# EAGLE design ControllerBoardSMDPSU (EAGLE 9.6.2)
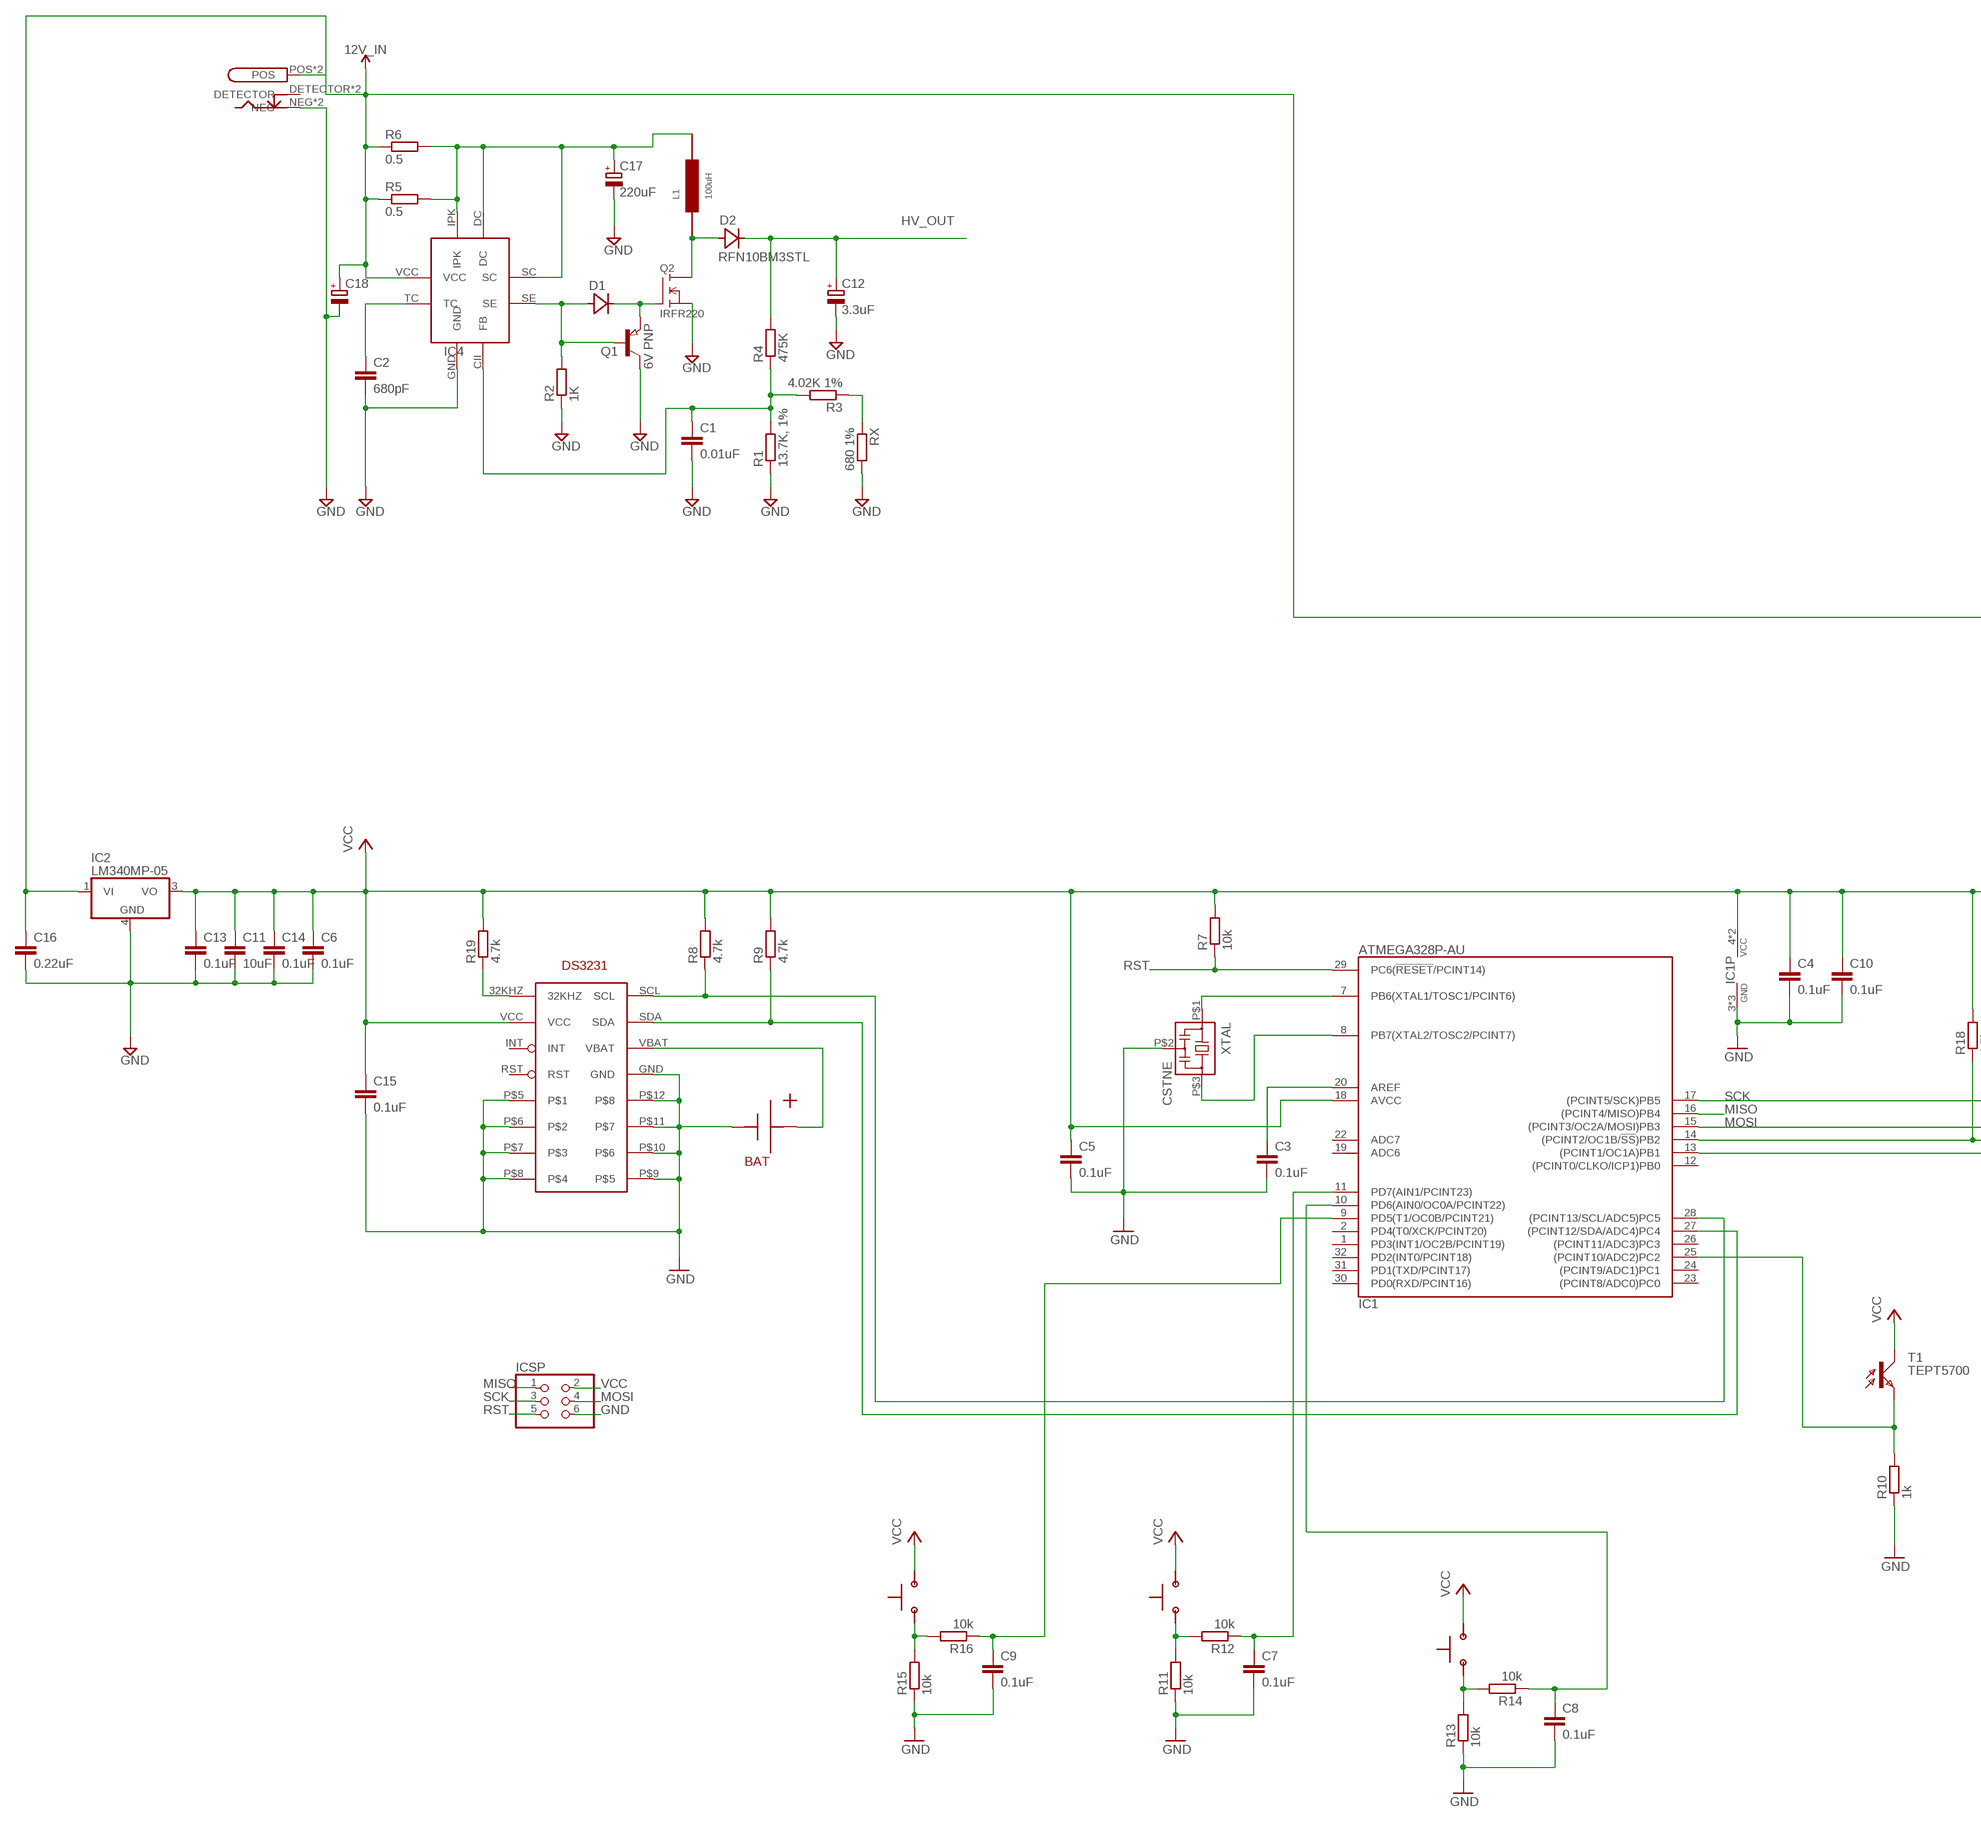
[diagram p0: schematic, sheet 1, part 1 of 2]
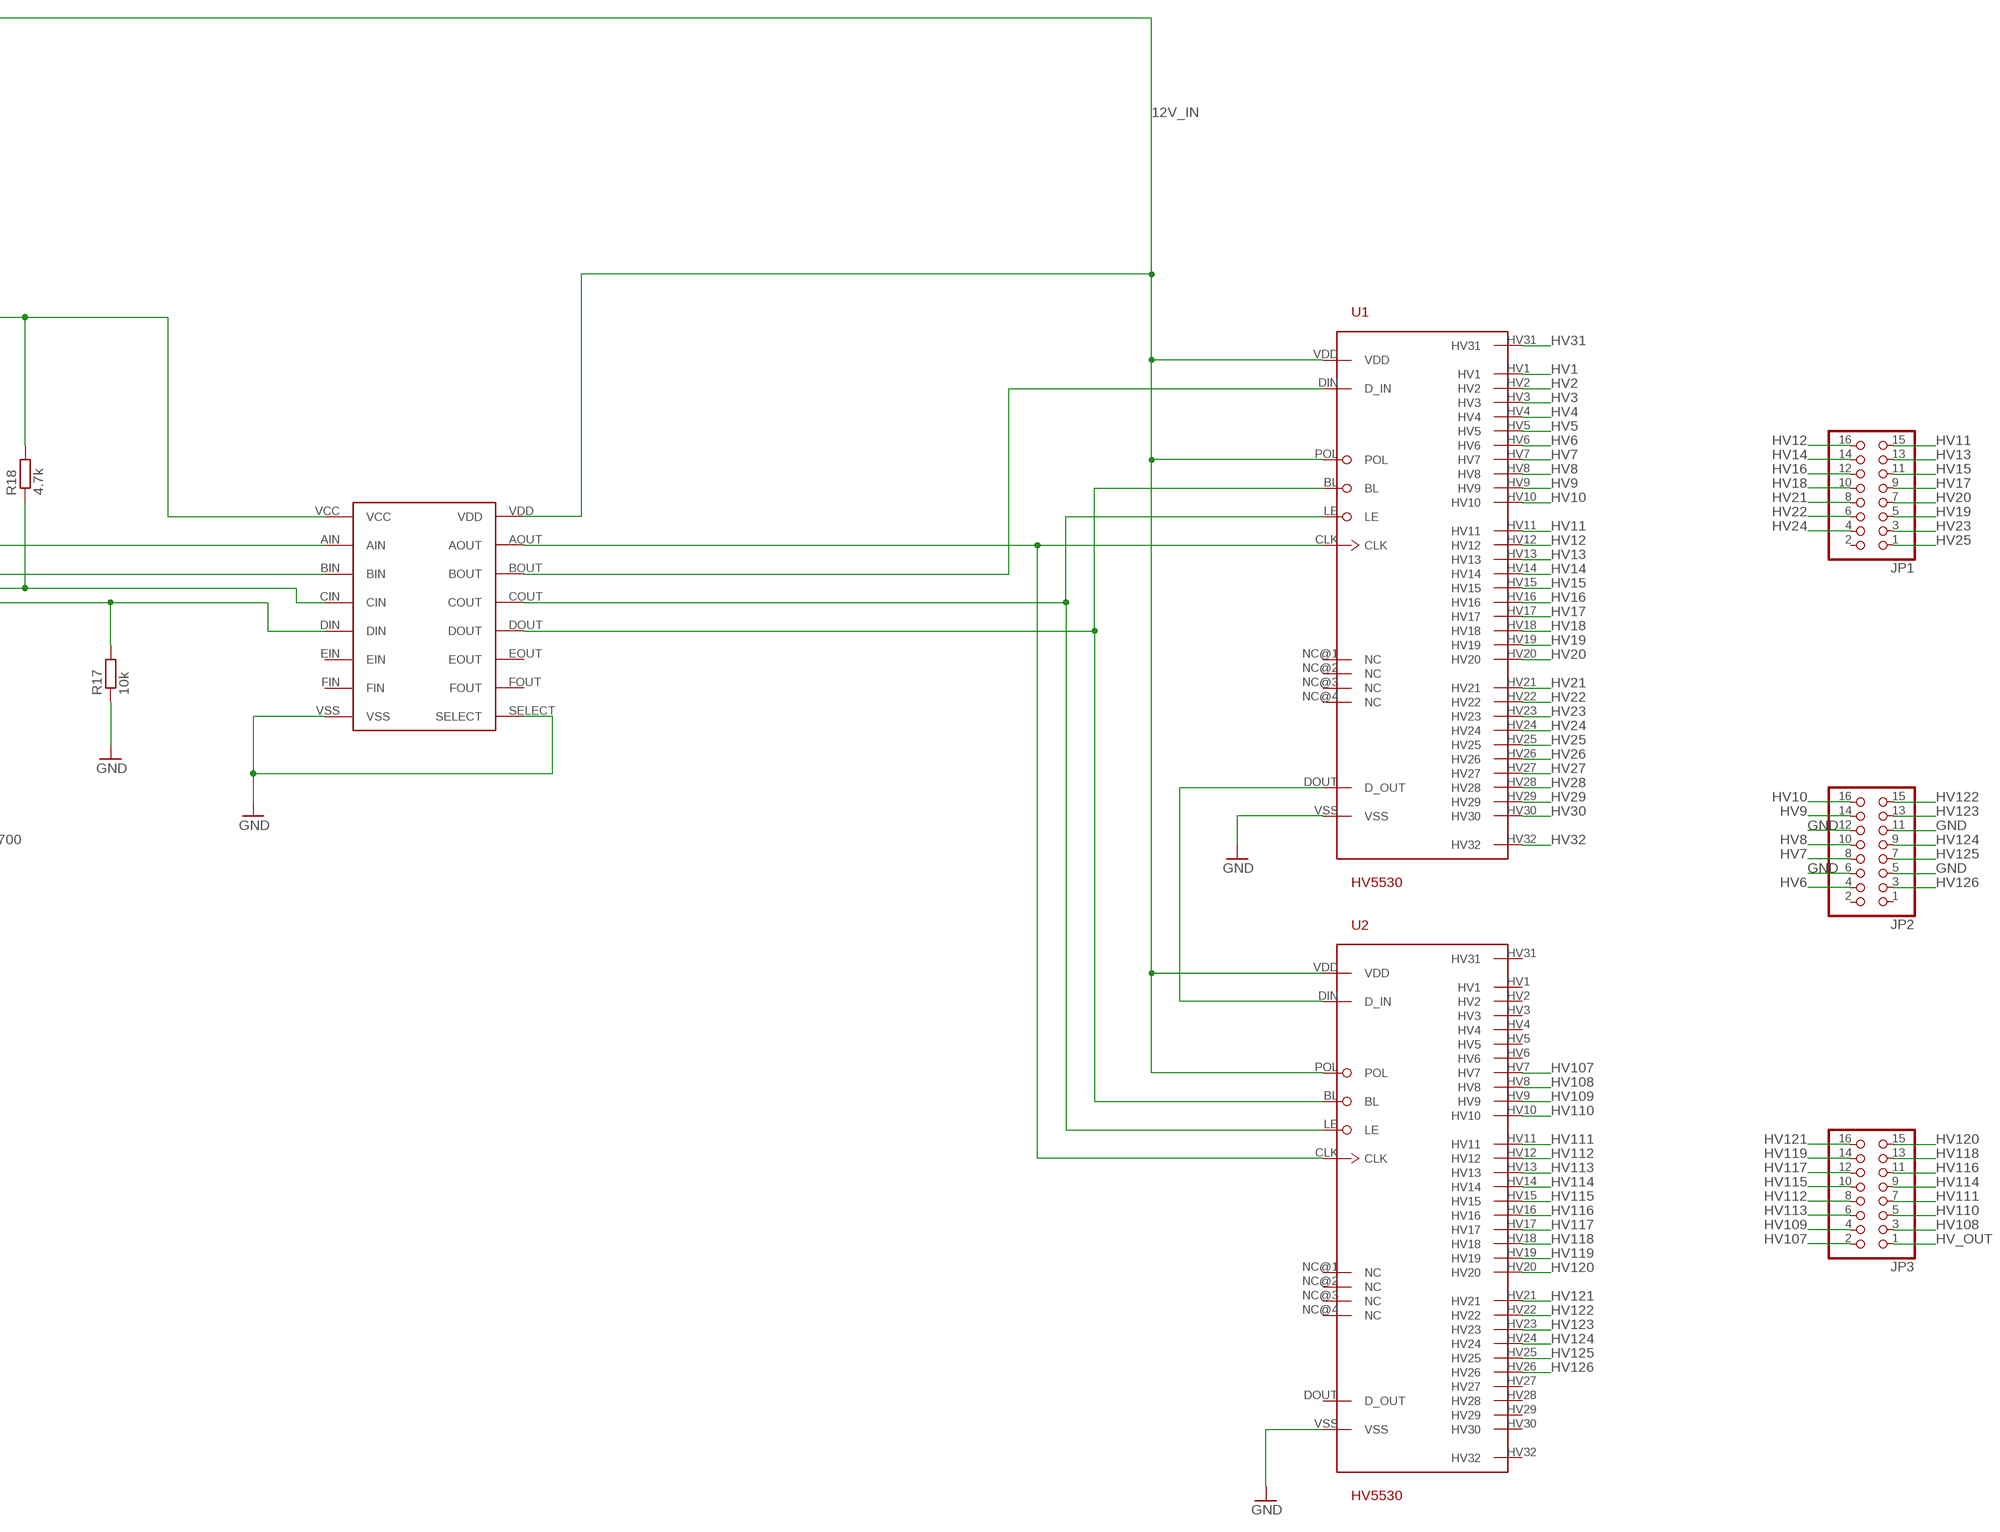
[diagram p1: schematic, sheet 1, part 2 of 2]

## Parts
12V  CUI_PWR_JACK  [CUI_PWR_JACK]
BAT  CR2032-SMD-HLDR  [CR2032-SMD]
C1  0.01uF  C-EUC0603  [C0603]
C2  680pF  C-EUC0603  [C0603]
C3  0.1uF  C-EUC0603  [C0603]
C4  0.1uF  C-EUC0603  [C0603]
C5  0.1uF  C-EUC0603  [C0603]
C6  0.1uF  C-EUC0603  [C0603]
C7  0.1uF  C-EUC0603  [C0603]
C8  0.1uF  C-EUC0603  [C0603]
C9  0.1uF  C-EUC0603  [C0603]
C10  0.1uF  C-EUC0603  [C0603]
C11  10uF  C-EUC0603  [C0603]
C12  3.3uF  CPOL-EU153CLV-0810  [153CLV-0810]
C13  0.1uF  C-EUC0603  [C0603]
C14  0.1uF  C-EUC0603  [C0603]
C15  0.1uF  C-EUC0603  [C0603]
C16  0.22uF  C-EUC0603  [C0603]
C17  220uF  CPOL-EU153CLV-0605  [153CLV-0605]
C18  CPOL-EU153CLV-0605  [153CLV-0605]
D1  SOT123DIODE  [SOD123]
D2  RFN10BM3STL  [TO252]
IC1  ATMEGA328P-AU  [QFP32_7X7_0.80]
IC2  LM340MP-05  [SOT223]
IC3  CD4504BTSSOP16  [SOP65P640X120-16N]
IC4  MC34063  MC34063ADR  [SOIC127P600X175-8]
ICSP  PINHD-2X3  [2X03]
JP1  PINHD-2X8  [2X08]
JP2  PINHD-2X8  [2X08]
JP3  PINHD-2X8  [2X08]
L1  100uH  SDR1105  [SDR1105]
Q1  6V PNP  PNP-TRANSISTOR_SOT23  [SOT23]
Q2  IRFR220  IRFR430  [DPAK]
R1  13.7K, 1%  R-EU_R1206  [R1206]
R2  1K  R-EU_R1206  [R1206]
R3  4.02K 1%  R-EU_R1206  [R1206]
R4  475K  R-EU_R1206  [R1206]
R5  0.5  R-EU_R1206  [R1206]
R6  0.5  R-EU_R1206  [R1206]
R7  10k  R-EU_R0603  [R0603]
R8  4.7k  R-EU_R0603  [R0603]
R9  4.7k  R-EU_R0603  [R0603]
R10  1k  R-EU_R0603  [R0603]
R11  10k  R-EU_R0603  [R0603]
R12  10k  R-EU_R0603  [R0603]
R13  10k  R-EU_R0603  [R0603]
R14  10k  R-EU_R0603  [R0603]
R15  10k  R-EU_R0603  [R0603]
R16  10k  R-EU_R0603  [R0603]
R17  10k  R-EU_R0603  [R0603]
R18  4.7k  R-EU_R0603  [R0603]
R19  4.7k  R-EU_R0603  [R0603]
RTC  DS3231-CORRECT  [SOIC16-CORRECT]
RX  680 1%  R-EU_R1206  [R1206]
S1  TL1105  [TL1105]
S2  TL1105  [TL1105]
S3  TL1105  [TL1105]
T1  TEPT5700  BPX81  [BPX81]
U1  HV5530  [44_PQFP_CORRECTED]
U2  HV5530  [44_PQFP_CORRECTED]
XTAL  CSTNE  [CSTNE]

## Nets
12V_IN [12V]: 12V.POS 12V.POS1(POS) C16.1 C18.+ IC2.1(VI) IC3.VDD IC4.VCC R5.1 R6.1 U1.POL U1.VDD U2.POL U2.VDD
GND: 12V.NEG 12V.NEG1(NEG) BAT.NEG C1.2 C2.2 C3.2 C4.2 C5.2 C6.2 C7.2 C8.2 C9.2 C10.2 C11.2 C12.- C13.2 C14.2 C15.2 C16.2 C17.- C18.- IC1.3(GND) IC1.5(GND) IC1.21(GND) IC2.4(GND) IC3.SELECT IC3.VSS IC4.GND ICSP.6 JP2.5 JP2.6 JP2.11 JP2.12 Q1.3(C) Q2.3(S) R1.1 R2.1 R10.1 R11.1 R13.1 R15.1 R17.1 RTC.GND RTC.P$5 RTC.P$6 RTC.P$7 RTC.P$8 RTC.P$9 RTC.P$10 RTC.P$11 RTC.P$12 RX.2 U1.VSS U2.VSS XTAL.P$2
HV1: U1.HV1
HV2: U1.HV2
HV3: U1.HV3
HV4: U1.HV4
HV5: U1.HV5
HV6: JP2.4 U1.HV6
HV7: JP2.8 U1.HV7
HV8: JP2.10 U1.HV8
HV9: JP2.14 U1.HV9
HV10: JP2.16 U1.HV10
HV11: JP1.15 U1.HV11
HV12: JP1.16 U1.HV12
HV13: JP1.13 U1.HV13
HV14: JP1.14 U1.HV14
HV15: JP1.11 U1.HV15
HV16: JP1.12 U1.HV16
HV17: JP1.9 U1.HV17
HV18: JP1.10 U1.HV18
HV19: JP1.5 U1.HV19
HV20: JP1.7 U1.HV20
HV21: JP1.8 U1.HV21
HV22: JP1.6 U1.HV22
HV23: JP1.3 U1.HV23
HV24: JP1.4 U1.HV24
HV25: JP1.1 U1.HV25
HV26: U1.HV26
HV27: U1.HV27
HV28: U1.HV28
HV29: U1.HV29
HV30: U1.HV30
HV31: U1.HV31
HV32: U1.HV32
HV107: JP3.2 U2.HV7
HV108: JP3.3 U2.HV8
HV109: JP3.4 U2.HV9
HV110: JP3.5 U2.HV10
HV111: JP3.7 U2.HV11
HV112: JP3.8 U2.HV12
HV113: JP3.6 U2.HV13
HV114: JP3.9 U2.HV14
HV115: JP3.10 U2.HV15
HV116: JP3.11 U2.HV16
HV117: JP3.12 U2.HV17
HV118: JP3.13 U2.HV18
HV119: JP3.14 U2.HV19
HV120: JP3.15 U2.HV20
HV121: JP3.16 U2.HV21
HV122: JP2.15 U2.HV22
HV123: JP2.13 U2.HV23
HV124: JP2.9 U2.HV24
HV125: JP2.7 U2.HV25
HV126: JP2.3 U2.HV26
HV_OUT [wide keepout]: C12.+ D2.3(C) JP3.1 R4.2
MISO: IC1.16((PCINT4/MISO)PB4) ICSP.1
MOSI: IC1.15((PCINT3/OC2A/MOSI)PB3) IC3.BIN ICSP.4
N$1: BAT.POS@1(POS) BAT.POS@2(POS) RTC.VBAT
N$2: IC1.7(PB6(XTAL1/TOSC1/PCINT6)) XTAL.P$1
N$3: IC1.8(PB7(XTAL2/TOSC2/PCINT7)) XTAL.P$3
N$4: R19.1 RTC.32KHZ
N$5: IC3.AOUT U1.CLK U2.CLK
N$6: U1.DOUT(D_OUT) U2.DIN(D_IN)
N$7: IC3.BOUT U1.DIN(D_IN)
N$8: C17.+ IC4.DC IC4.IPK IC4.SC L1.P$2 R5.2 R6.2
N$9: C2.1 IC4.TC
N$10: D1.2(A) IC4.SE Q1.1(B) R2.2
N$11: D1.1(C) Q1.2(E) Q2.1(G)
N$12: D2.1(A) D2.2(A) L1.P$1 Q2.2(D)
N$13: C1.1 IC4.CII(FB) R1.2 R3.2 R4.1
N$14: IC1.14((PCINT2/OC1B/!SS!)PB2) IC3.CIN R18.1
N$15: IC1.13((PCINT1/OC1A)PB1) IC3.DIN R17.2
N$16: IC3.COUT U1.LE U2.LE
N$17: IC3.DOUT U1.BL U2.BL
N$18: C3.1 IC1.20(AREF)
N$19: IC1.25((PCINT10/ADC2)PC2) R10.2 T1.E
N$20: R3.1 RX.1
N$21: R13.2 R14.2 S2.1 S2.2
N$22: R11.2 R12.2 S1.1 S1.2
N$23: C8.1 IC1.10(PD6(AIN0/OC0A/PCINT22)) R14.1
N$24: C7.1 IC1.11(PD7(AIN1/PCINT23)) R12.1
N$25: R15.2 R16.2 S3.1 S3.2
N$26: C9.1 IC1.9(PD5(T1/OC0B/PCINT21)) R16.1
RST: IC1.29(PC6(!RESET!/PCINT14)) ICSP.5 R7.1
SCK: IC1.17((PCINT5/SCK)PB5) IC3.AIN ICSP.3
SCL: IC1.28((PCINT13/SCL/ADC5)PC5) R8.1 RTC.SCL
SDA: IC1.27((PCINT12/SDA/ADC4)PC4) R9.1 RTC.SDA
VCC: C4.1 C5.1 C6.1 C10.1 C11.1 C13.1 C14.1 C15.1 IC1.4(VCC) IC1.6(VCC) IC1.18(AVCC) IC2.3(VO) IC3.VCC ICSP.2 R7.2 R8.2 R9.2 R18.2 R19.2 RTC.VCC S1.3 S1.4 S2.3 S2.4 S3.3 S3.4 T1.C
Unconnected: 12V.DETECTOR 12V.DETECTOR1(DETECTOR) IC1.1(PD3(INT1/OC2B/PCINT19)) IC1.2(PD4(T0/XCK/PCINT20)) IC1.12((PCINT0/CLKO/ICP1)PB0) IC1.19(ADC6) IC1.22(ADC7) IC1.23((PCINT8/ADC0)PC0) IC1.24((PCINT9/ADC1)PC1) IC1.26((PCINT11/ADC3)PC3) IC1.30(PD0(RXD/PCINT16)) IC1.31(PD1(TXD/PCINT17)) IC1.32(PD2(INT0/PCINT18)) IC3.EIN IC3.EOUT IC3.FIN IC3.FOUT JP1.2 JP2.1 JP2.2 RTC.INT RTC.RST U1.NC@1(NC) U1.NC@2(NC) U1.NC@3(NC) U1.NC@4(NC) U2.DOUT(D_OUT) U2.HV1 U2.HV2 U2.HV3 U2.HV4 U2.HV5 U2.HV6 U2.HV27 U2.HV28 U2.HV29 U2.HV30 U2.HV31 U2.HV32 U2.NC@1(NC) U2.NC@2(NC) U2.NC@3(NC) U2.NC@4(NC)

## Library data of the parts
12V = CUI_PWR_JACK:CUI_PWR_JACK
BAT = CR2032:CR2032-SMD-HLDR
C1-C11 C13-C16 = rcl:C-EU: CAPACITOR, European symbol; SPICEPREFIX: C
C12 C17 C18 = rcl:CPOL-EU: POLARIZED CAPACITOR, European symbol; SPICEPREFIX: C
D1 = SMDPSU:SOT123DIODE
D2 = SMDPSU:RFN10BM3STL
IC1 = atmel:ATMEGA*8: 8-bit AVR Microcontroller 4/8/16/32 kbytes flash 512/1k/1k/2k bytes SRAM 256/512/512/1k bytes EEPROM USART, 6/8-channel 10 bit ADC Pin compatible with Atmega8(L,A) Note: ADC6 and ADC7 are not available in 28-lead packages
IC2 = linear:LM340?-*: Positive VOLTAGE REGULATOR Source: http://cache.national.com/ds/LM/LM340.pdf
IC3 = CD4504B:CD4504B
IC4 = NixiePSU-Lib:MC34063
ICSP = pinhead:PINHD-2X3: PIN HEADER
JP1-JP3 = pinhead:PINHD-2X8: PIN HEADER
L1 = SMDPSU:SDR1105
Q1 = semicon-smd-ipc:PNP-TRANSISTOR_: PNP TRANSISTOR
Q2 = transistor-fet:IRFR430: N-Channel HEXFET
R1-R19 RX = rcl:R-EU_: RESISTOR, European symbol; SPICEPREFIX: R
RTC = DS3231:DS3231-CORRECT
S1-S3 = TL1105:TL1105
T1 = opto-trans-siemens:BPX81: PHOTO TRANSISTOR; OC_FARNELL: unknown; OC_NEWARK: unknown
U1 U2 = HV5530:HV5530
XTAL = CSTNE-Resonator:CSTNE

## Net classes
1 wide keepout: clearance 0.508 mm
2 12V: width 0.254 mm, clearance 0.508 mm

## Board
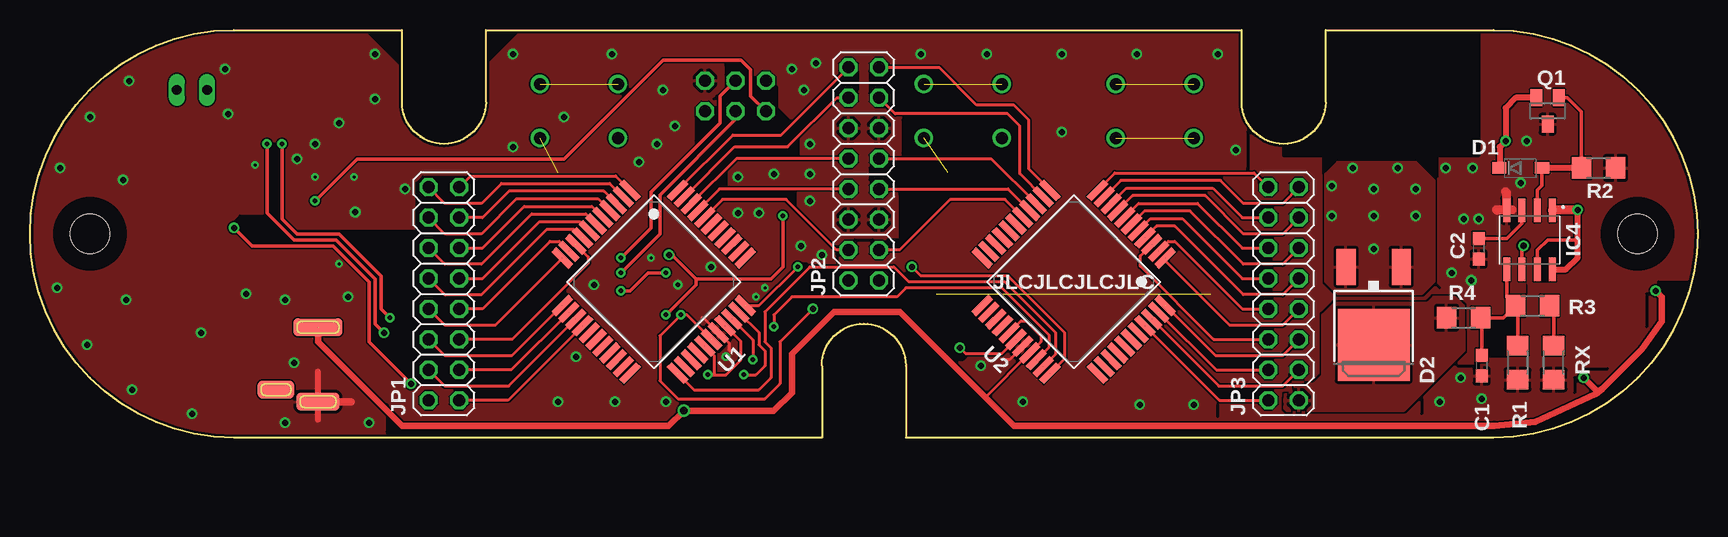
[diagram p2: board, top side]
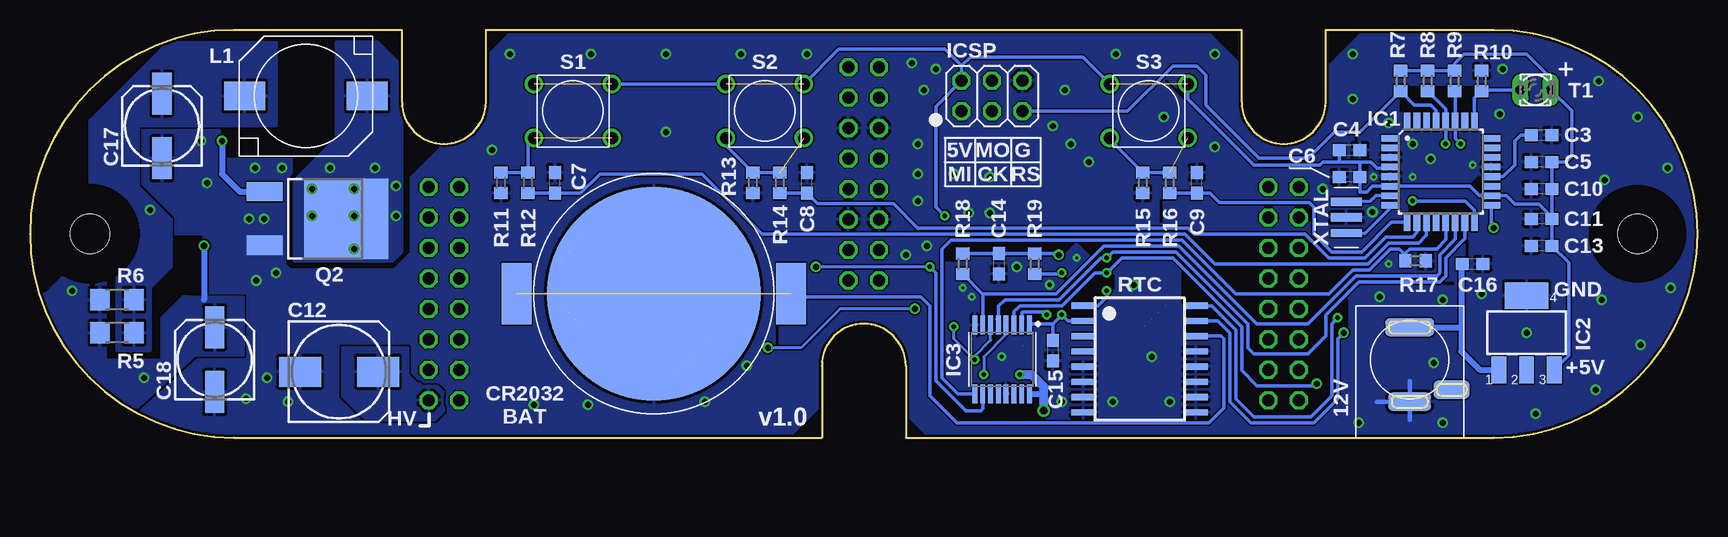
[diagram p3: board, bottom side, seen from below]

Size 139 x 34 mm. Coordinates in mm from the lower left corner, seen from the top.
Outline: 122,34 arc-180 122,0 73,0 73,6 arc180 66,6 66,0 17,0 arc-180 17,34 31,34 31,28 arc180 38,28 38,34 101,34 101,28 arc180 108,28 108,34 122,34
Copper layers (1*16): Top 0.035mm / dielectric 1.5mm / Bottom 0.035mm
Design rules "default *": minimum track width 6mil, minimum drill 0.2mm, track to track 5mil, track to pad 6mil, pad to pad 5mil, via to via 6mil, smd to smd 5mil, copper to edge 0.2mm, drill to drill 0.5mm, minimum pad ring 10mil, minimum via ring 8mil, stop-mask expansion 4mil, vias tented up to drill 0mil, thermal gap 10mil
Holes 3.3 mm at 5,17 134,17
tRestrict: area 104.5,23.5 to 120.8,35; area 131,14 to 137,20; area 2,14 to 8,20; 49 lines
bRestrict: area 130,13 to 138,21; area 1,13 to 9,21; 44 lines

### Footprints (pad centres in the part's own frame; a part is rotated, then mirrored left to right if it is on the bottom)
CUI_PWR_JACK = smd 3.048 x 1.524: DETECTOR 3.5,-2.5 | smd 3.048 x 1.524 bottom: DETECTOR1 3.5,-2.5 | smd 3.556 x 1.524: NEG 0,-3.5 | smd 3.556 x 1.524 bottom: NEG1 0,-3.5 | smd 4.064 x 1.524: POS 0,2.7 | smd 4.064 x 1.524 bottom: POS1 0,2.7
CR2032-SMD = smd 17.8 x 17.8: NEG 0,0 | smd 2.5 x 5.1: POS@1 -11.45,0; POS@2 11.45,0
C0603 = smd 1.1 x 1: 1 -0.85,0; 2 0.85,0
153CLV-0810 = smd 3.5 x 2.5: + 3.25,0; - -3.25,0
153CLV-0605 = smd 3.5 x 1.6: + 2.7,0; - -2.7,0
SOD123 = smd 1.2 x 0.95: 1 -1.775,0; 2 1.775,0
TO252 = smd 1.6 x 3: 1 -2.3,-5; 2 2.3,-5 | smd 6 x 6: 3 0,1.5
QFP32_7X7_0.80 = smd 1.5 x 0.55: 1 -4.2,2.8; 2 -4.2,2; 3 -4.2,1.2; 4 -4.2,0.4; 5 -4.2,-0.4; 6 -4.2,-1.2; 7 -4.2,-2; 8 -4.2,-2.8; 17 4.2,-2.8; 18 4.2,-2; 19 4.2,-1.2; 20 4.2,-0.4; 21 4.2,0.4; 22 4.2,1.2; 23 4.2,2; 24 4.2,2.8 | smd 0.55 x 1.5: 9 -2.8,-4.2; 10 -2,-4.2; 11 -1.2,-4.2; 12 -0.4,-4.2; 13 0.4,-4.2; 14 1.2,-4.2; 15 2,-4.2; 16 2.8,-4.2; 25 2.8,4.2; 26 2,4.2; 27 1.2,4.2; 28 0.4,4.2; 29 -0.4,4.2; 30 -1.2,4.2; 31 -2,4.2; 32 -2.8,4.2
SOT223 = smd 1.219 x 2.235: 1 -2.311,-3.099; 2 0,-3.099; 3 2.311,-3.099 | smd 3.6 x 2.2: 4 0,3.099
SOP65P640X120-16N = smd 1.572 x 0.407: AIN -2.872,0.975; AOUT -2.872,1.625; BIN -2.872,-0.325; BOUT -2.872,0.325; CIN -2.872,-1.625; COUT -2.872,-0.975; DIN 2.872,-2.275; DOUT 2.872,-1.625; EIN 2.872,-0.975; EOUT 2.872,-0.325; FIN 2.872,0.975; FOUT 2.872,1.625; SELECT 2.872,0.325; VCC -2.872,2.275; VDD 2.872,2.275; VSS -2.872,-2.275
SOIC127P600X175-8 = smd 1.968 x 0.599: CII 2.473,-1.905; DC 2.473,1.905; GND -2.473,-1.905; IPK 2.473,0.635; SC -2.473,1.905; SE -2.473,0.635; TC -2.473,-0.635; VCC 2.473,-0.635
2X03 = drill 1.016 octagon: 1 -2.54,-1.27; 2 -2.54,1.27; 3 0,-1.27; 4 0,1.27; 5 2.54,-1.27; 6 2.54,1.27
2X08 = drill 1.016 octagon: 1 -8.89,-1.27; 2 -8.89,1.27; 3 -6.35,-1.27; 4 -6.35,1.27; 5 -3.81,-1.27; 6 -3.81,1.27; 7 -1.27,-1.27; 8 -1.27,1.27; 9 1.27,-1.27; 10 1.27,1.27; 11 3.81,-1.27; 12 3.81,1.27; 13 6.35,-1.27; 14 6.35,1.27; 15 8.89,-1.27; 16 8.89,1.27
SDR1105 = smd 2.4 x 3.4: P$1 0,5.1; P$2 0,-5.1
SOT23 = smd 1 x 1.4: 1 -0.95,-1.1; 2 0.95,-1.1; 3 0,1.1
DPAK = smd 1.6 x 2.997: 1 -2.261,-4.928; 3 2.21,-4.928 | smd 6.7 x 7: 2 0,1.853
R1206 = smd 1.6 x 1.803: 1 -1.422,0; 2 1.422,0
R0603 = smd 1 x 1.1: 1 -0.85,0; 2 0.85,0
SOIC16-CORRECT = smd 1.98 x 0.53: 32KHZ -4.685,0; GND 4.685,-3.81; INT -4.685,-2.54; P$5 -4.685,-5.08; P$6 -4.685,-6.35; P$7 -4.685,-7.62; P$8 -4.685,-8.89; P$9 4.685,-8.89; P$10 4.685,-7.62; P$11 4.685,-6.35; P$12 4.685,-5.08; RST -4.685,-3.81; SCL 4.685,0; SDA 4.685,-1.27; VBAT 4.685,-2.54; VCC -4.685,-1.27
TL1105 = drill 1: 1 0,0; 2 6.5,0; 3 0,4.5; 4 6.5,4.5
BPX81 = drill 0.813 long: C 1.27,0; E -1.27,0
44_PQFP_CORRECTED = smd 0.55 x 2: BL -4,6.8; CLK 0,6.8; DIN -3.2,6.8; DOUT 4,6.8; HV11 -4,-6.8; HV12 -3.2,-6.8; HV13 -2.4,-6.8; HV14 -1.6,-6.8; HV15 -0.8,-6.8; HV16 0,-6.8; HV17 0.8,-6.8; HV18 1.6,-6.8; HV19 2.4,-6.8; HV20 3.2,-6.8; HV21 4,-6.8; LE -2.4,6.8; NC@1 3.2,6.8; NC@2 2.4,6.8; NC@3 1.6,6.8; POL 0.8,6.8; VDD -1.6,6.8; VSS -0.8,6.8 | smd 2 x 0.55: HV1 -6.8,3.2; HV2 -6.8,2.4; HV3 -6.8,1.6; HV4 -6.8,0.8; HV5 -6.8,0; HV6 -6.8,-0.8; HV7 -6.8,-1.6; HV8 -6.8,-2.4; HV9 -6.8,-3.2; HV10 -6.8,-4; HV22 6.8,-4; HV23 6.8,-3.2; HV24 6.8,-2.4; HV25 6.8,-1.6; HV26 6.8,-0.8; HV27 6.8,0; HV28 6.8,0.8; HV29 6.8,1.6; HV30 6.8,2.4; HV31 6.8,3.2; HV32 6.8,4; NC@4 -6.8,4
CSTNE = smd 2.6 x 0.7: P$1 0,1.3; P$2 0,0; P$3 0,-1.3

### Placement (x,y rotation side)
12V  24,6.5 0 bottom
BAT  87,12 0 bottom
C1  121,6 270 top
C2  120.75,15.75 270 top
C3  13,25.25 0 bottom
C4  29,24 0 bottom
C5  13,23 180 bottom
C6  29,21.75 180 bottom
C7  95.25,21.25 90 bottom
C8  74.25,21.25 90 bottom
C9  41.75,21.25 90 bottom
C10  13,20.75 180 bottom
C11  13,18.25 180 bottom
C12  113.25,5.5 0 bottom
C13  13,16 180 bottom
C14  58.25,14.5 270 bottom
C15  53.75,7.25 270 bottom
C16  18.75,14.5 0 bottom
C17  128,26 90 bottom
C18  123.6,6.5 90 bottom
D1  124.25,22.5 0 top
D2  112,9.25 180 top
IC1  21.4,22.18 0 bottom
IC2  14.25,8.75 0 bottom
IC3  57.96,6.52 270 bottom
IC4  125,16.5 270 top
ICSP  58.81,28.5 0 bottom
JP1  34.5,12 90 top
JP2  69.5,22 90 top
JP3  104.5,12 90 top
L1  116,28.5 270 bottom
Q1  126.5,27.25 180 top
Q2  114.5,18.25 270 bottom
R1  124,6.25 90 top
R2  130.75,22.5 180 top
R3  125.25,11 180 top
R4  119.5,10 180 top
R5  131.75,8.75 0 bottom
R6  131.75,11.5 0 bottom
R7  24.75,29.75 90 bottom
R8  22.5,29.75 90 bottom
R9  20.25,29.75 90 bottom
R10  18,29.75 270 bottom
R11  99.75,21.25 90 bottom
R12  97.5,21.25 90 bottom
R13  78.75,21.25 90 bottom
R14  76.5,21.25 90 bottom
R15  46.25,21.25 90 bottom
R16  44,21.25 90 bottom
R17  23.5,14.75 180 bottom
R18  61.25,14.5 90 bottom
R19  55.25,14.5 90 bottom
RTC  46.5,11 0 bottom
RX  127,6.25 270 top
S1  97,25 0 bottom
S2  81,25 0 bottom
S3  49,25 0 bottom
T1  13.5,29 0 bottom
U1  52,13 225 top
U2  87,13 135 top
XTAL  29.27,18.36 0 bottom

### Tracks (layer width: path | path; a pad name or v marks a point on that pad's centre or on a via)
12V_IN  (via drill 0.35, 0.5, 0.51, 0.6)  (3 unrouted)
  Top 0.254: v56.5,5.25 57,5.25 | 57,5.25 57,6.87 U1.POL | U1.VDD 59.25,8.01 59.25,6.5 58,5.25 57,5.25 | 79.62,3.38 79.64,3.38 U2.VDD 84.25,7.99 84.25,8.5 83,9.75 82.62,9.75 U2.POL
  Top 0.305: v124.5,16 124.36,15.87 IC4.VCC
  Top 0.559: 12V.POS1 24,8 31.03,0.97 53.22,0.97 v54.5,2.25 54.53,2.22 61.97,2.22 63.5,3.75 63.5,7 67,10.5 72.5,10.5 79.62,3.38 82,1 122.06,1 125.46,1.3 130.51,3.65 131.07,4.05 134.37,7.34 136,9.67 136,11.75 v135.5,12.25 | v129.5,5 130.47,4.03
  Bottom 0.508: IC3.VDD 54.6,3.65 54.5,3.75 | v124.5,16 124.5,11.5 | C16.1 19.7,14.4 19.7,9.2 | IC2.1 18.15,5.65 19.7,7.2 19.7,9.2 | 12V.POS1 19.7,9.2
  Bottom 0.762: 16.56,5.9 IC2.1 | v54.5,2.25 54.5,3.75 54.5,4.25 55.5,5.25 v56.5,5.25
  pour Bottom: 132.75,6.42 132.75,13.5 139,13.5 139,1.5 131.25,1.5 125.21,6.9 121.25,6.9 121.25,11.7 125.75,11.75 126.25,11.75 128,10 128,6.42
GND  (via drill 0.25, 0.3, 0.35, 0.5)
  Top 0.254: U2.VSS 81.63,6.5 81.25,6.5 | 58.35,7.25 58.25,7.35 58.25,7.88 U1.VSS 56.13,10 56,10
  Top 0.508: 24,1.5 12V.NEG1 24,5.5
  Top 0.635: 26.75,3 12V.NEG1
  Top 0.762: IC4.GND 122.28,18.97 122.25,19 | IC4.GND 123.09,20.41 123,20.5 | IC4.GND 123.25,18.97 123.29,19.01 123.53,19.01
  Bottom 0.381: 12V.NEG1 24,4.75 | 12V.NEG1 24,1.5 | 26.75,3 12V.NEG1
  other vias: 79.25,6 60.5,11.75 61.25,12.5 23.75,21.75 27,21.75 53,3 47,12.75 59,18.75 60.75,18.75 51.75,15 25.75,14.5 5,26.75 8,11.5 14.25,8.75 18,12 52.25,24.5 66,15.25 100.5,24 99,32 92.25,32 86,32 79.75,32 48.5,32 40.25,32 28.75,32 28.75,28.25 44.5,26.75 8.25,29.75 2.5,22.5 2.25,12.5 4.75,7.75 13.5,2 21.25,1.25 28.25,1.25 82.75,3 92.5,2.75 97,2.75 118,22.5 120.75,18.25 118.5,13.75 120.15,13.1 119.25,5 124.25,21.25 124.75,24.75 121,3.25 120.25,22.5 119.5,18.25 40.25,24.25 117.5,3 45.5,6.75 44,3 48.75,3 50.75,23 53.75,26 52.75,29 63.5,30.75 64.5,29 65.5,31.25 65,24.5 59,21.75 62,22 65,22 65,19.75 64.25,16 86,25.5 22,6.25 31.25,20.75 23.75,24.5 18.75,22.75 22.25,23.25 16.5,27 16.25,30.75 7.75,21.5 8.5,4 56.75,14.25 54,12.75 27.1,18.8 21.25,11.5 26.5,11.75 74.25,32 25.75,26.25 58,6.75
  pour Bottom (rank 2): 0,34 0,0 140,0 140,34
  pour Top (rank 2): 0.26,34 139.25,34 139.25,0 -0.01,0
HV6
  Top 0.254: JP2.4 67.25,15.65 63.04,19.86 57.73,19.86 U1.HV6
HV7
  Top 0.254: JP2.8 57.47,20.73 U1.HV7
HV8
  Top 0.254: JP2.10 58.88,23.27 U1.HV8
HV9
  Top 0.254: U1.HV9 58.74,24.26 63.16,24.26 67.25,28.35 JP2.14
HV10
  Top 0.254: U1.HV10 58.59,25.25 62.61,25.25 68.23,30.87 JP2.16
HV11
  Top 0.254: JP1.15 36.71,21.83 48.83,21.83 U1.HV11
HV12
  Top 0.254: U1.HV12 48.33,21.2 39.29,21.2 37.64,19.54 34.58,19.54 JP1.16
HV13
  Top 0.254: U1.HV13 47.83,20.56 39.93,20.56 37.72,18.35 JP1.13
HV14
  Top 0.254: U1.HV14 47.34,19.93 40.56,19.93 37.64,17 34.58,17 JP1.14
HV15
  Top 0.254: JP1.11 37.72,15.81 41.2,19.29 46.84,19.29 U1.HV15
HV16
  Top 0.254: U1.HV16 46.34,18.66 41.83,18.66 37.64,14.46 34.58,14.46 JP1.12
HV17
  Top 0.254: JP1.9 37.72,13.27 42.47,18.02 45.85,18.02 U1.HV17
HV18  (1 unrouted)
  Top 0.254: JP1.10 34.58,11.92 37.64,11.92 43.1,17.39 45.35,17.39 U1.HV18
HV19  (1 unrouted)
  Top 0.254: U1.HV19 46.53,15.08 46.53,14.53 40.19,8.19 JP1.5
HV20  (1 unrouted)
  Top 0.254: U1.HV20 44.11,16.36 43.35,16.36 37.72,10.73 JP1.7
HV21  (1 unrouted)
  Top 0.254: U1.HV21 44.36,14.94 38.79,9.37 34.59,9.37 JP1.8
HV22  (1 unrouted)
  Top 0.254: JP1.6 34.58,6.84 40.18,6.84 U1.HV22
HV23  (1 unrouted)
  Top 0.254: JP1.3 40.12,5.65 U1.HV23
HV24  (1 unrouted)
  Top 0.254: JP1.4 34.58,4.3 39.91,4.3 U1.HV24
HV25  (1 unrouted)
  Top 0.254: U1.HV25 39.85,3.11 JP1.1
HV107  (1 unrouted)
  Top 0.254: U2.HV7 99.15,3.11 JP3.2
HV108  (1 unrouted)
  Top 0.254: U2.HV8 99.09,4.3 104.42,4.3 JP3.3
HV109  (1 unrouted)
  Top 0.254: U2.HV9 98.88,5.65 JP3.4
HV110  (1 unrouted)
  Top 0.254: U2.HV10 98.82,6.84 104.42,6.84 JP3.5
HV111  (1 unrouted)
  Top 0.254: U2.HV11 94.64,14.73 99.98,9.38 104.42,9.38 JP3.7
HV112  (1 unrouted)
  Top 0.254: U2.HV12 94.89,16.36 95.42,16.36 101.06,10.73 JP3.8
HV113  (1 unrouted)
  Top 0.254: JP3.6 98.65,8.19 92.55,14.3 92.55,15.15 U2.HV13
HV114  (1 unrouted)
  Top 0.254: JP3.9 104.42,11.92 101.14,11.92 95.42,17.64 93.9,17.64 U2.HV14
HV115
  Top 0.254: U2.HV15 93.4,18.27 96.06,18.27 101.06,13.27 JP3.10
HV116
  Top 0.254: JP3.11 104.42,14.46 101.14,14.46 96.69,18.91 92.91,18.91 U2.HV16
HV117
  Top 0.254: U2.HV17 92.41,19.54 97.33,19.54 101.06,15.81 JP3.12
HV118
  Top 0.254: JP3.13 104.42,17 101.14,17 97.96,20.18 91.91,20.18 U2.HV18
HV119
  Top 0.254: U2.HV19 91.42,20.81 98.6,20.81 101.06,18.35 JP3.14
HV120
  Top 0.254: JP3.15 104.42,19.54 101.14,19.54 99.23,21.45 90.92,21.45 U2.HV20
HV121
  Top 0.254: U2.HV21 90.42,22.08 102.04,22.08 JP3.16
HV122
  Top 0.254: JP2.15 75.77,30.89 78.91,27.75 82,27.75 83.25,26.5 83.25,22.41 U2.HV22
HV123
  Top 0.254: JP2.13 72.11,27.01 81.49,27.01 82.51,25.99 82.51,22.01 U2.HV23
HV124
  Top 0.254: JP2.9 80.12,23.27 U2.HV24
HV125
  Top 0.254: JP2.7 81.53,20.73 U2.HV25
HV126
  Top 0.254: U2.HV26 81.27,19.86 76.69,19.86 72.48,15.65 JP2.3
HV_OUT
  pour Top: 104.25,2.75 104.25,3.5 105.25,4.5 107,4.5 107.75,5.25 107.75,10.25 108.75,11.25 116.5,11.25 117,11.75 118.75,11.75 119.5,11 119.5,7.25 114.5,2.25 104.75,2.25
  pour Bottom: 104.5,2.25 104.5,3.75 105.25,4.5 106.75,4.5 107.5,5.25 107.5,7.5 113,7.5 113,3.5 111,1.5 105.25,1.5
MISO  (via drill 0.35)
  Top 0.305: v23.75,19.75 27.25,23.25 44.5,23.25 52.75,31.5 59.25,31.5 60.08,30.67 60.08,28.5 ICSP.1
  Bottom 0.305: IC1.16 18.6,18.98 19.35,19.73 23.73,19.73 v23.75,19.75
MOSI  (via drill 0.35)
  Top 0.305: ICSP.4 57.5,28.46 57.5,26.25 51.75,20.5 51.75,17.5 v49.25,15
  Bottom 0.305: IC1.15 19.4,16.6 21,15 21,13.5 21.5,13 28.25,13 31,10.25 31,8.5 32.5,7 37,7 37.5,7.5 37.5,9.5 43.5,15.5 48.75,15.5 v49.25,15 49.75,15 53.25,11.5 57.75,11.5 58.28,10.97 IC3.BIN
N$1  (1 unrouted)
  Bottom 0.305: BAT.POS@2 75.3,11.75 64.75,11.75 64,11 64,3.5 61.74,1.25 40.75,1.25 39.5,2.5 39.5,8.25 39.71,8.46 RTC.VBAT
N$2
  Bottom 0.305: IC1.7 26.82,20.18 27.29,19.71 XTAL.P$1
N$3
  Bottom 0.305: IC1.8 25.6,19.15 27.73,17.02 XTAL.P$3
N$4  (via drill 0.35)
  Top 0.305: v49.25,12.25 50,12.25 51.5,13.75 v53,13.75
  Bottom 0.305: v49.25,12.25 49.25,11.75 50,11 RTC.32KHZ | R19.1 53.1,13.65 v53,13.75
N$5  (via drill 0.35, 0.5)  (2 unrouted)
  Top 0.254: U1.CLK 54.75,10.25 v54.25,10.25 52.5,8.5 52.5,4.75 54,3.25 61.25,3.25 62.5,4.5 62.5,8 v65.25,10.75 | U2.CLK 81,7 78.25,7 78,7 v77.5,7.5
  Bottom 0.254: v65.25,10.75 71.5,10.75 74.75,7.5 v77.5,7.5
  Bottom 0.305: IC3.AOUT 56.33,10.42 56.25,10.5 54.5,10.5 v54.25,10.25
N$6  (2 unrouted)
  Top 0.254: U1.DOUT 55.34,4 60.75,4 61.75,5 61.75,7.5 61.25,8 61.25,10.5 65,14.25 72,14.25 73.25,13 81.25,13 85.5,8.75 85.5,6.97 U2.DIN
N$7  (via drill 0.35)  (1 unrouted)
  Top 0.254: U1.DIN 60.75,8.78 60.75,7.75 61.25,7.25 61.25,6 60.5,5.25 v59.5,5.25
  Bottom 0.254: v59.5,5.25 59.5,6.75 57.63,8.62 IC3.BOUT
N$8  (via drill 0.5)
  Top 0.305: IC4.IPK 125.64,15.63 126.5,16.5 129,16.5
  Top 0.508: IC4.DC 128.03,14.03 129,15 129,16.5 v129,19
  Top 0.762: v129,19 128.97,18.97 IC4.SC
  pour Bottom: 118.5,33 118.5,26 130,26 130,21 127.25,18.25 127.25,14.25 129,12.5 129,7.25 131.75,7.25 131.75,15.75 131,16.5 131,17.5 134,20.5 134,26.5 127.5,33
N$9
  Top 0.305: C2.1 123.1,16.6 124.36,17.86 IC4.TC
N$10
  Top 0.305: IC4.SE 125.64,20.64 126.03,21.02 D1.2 | R2.2 129.33,27.17 128.15,28.35 Q1.1
  Top 0.508: R2.2 D1.2
N$11  (via drill 0.5)
  Top 0.508: Q1.2 123.85,28.35 123,27.5 v123,24.75 122.5,24.25 122.5,22.52 D1.1
  Bottom 0.508: v123,24.75 123,22 121.51,20.51 Q2.1
N$12  (via drill 0.5)
  other vias: 110.25,22.5 108.5,21 108.5,18.5 112,20.75 115.5,20.75 112,18.5 115.5,18.5 112,15.75 114,22.5
  pour Bottom: 108,31 110,33 113.5,33 113.5,25 117,21.5 117,14.75 108.75,14.75 108,15.5
  pour Top: 109,12 108,13 108,22 109,23 115.5,23 117,21.5 117,13 116,12
N$13
  Top 0.305: IC4.CII 123.09,11.73 R3.2 | R3.2 122.83,10 R4.1 121,9.92 C1.1 | R3.2 124,10.83 R1.2
N$14
  Bottom 0.305: IC1.14 20.2,16.55 21.5,15.25 21.5,13.75 21.75,13.5 28.5,13.5 32.5,9.5 36.75,9.5 43.25,16 49.5,16 53.5,12 59.58,12 | R18.1 59.6,12 59.58,12 | 59.58,12 IC3.CIN
N$15
  Bottom 0.305: IC1.13 21,16.5 21.75,15.75 24,15.75 24.35,15.4 R17.2 24.35,15.25 24.85,15.75 25.6,15.75 27.35,14 28.75,14 30.75,12 38.5,12 43,16.5 62.25,16.5 63,15.75 63,5 61.65,3.65 IC3.DIN
N$16  (via drill 0.35)  (2 unrouted)
  Top 0.254: U1.LE 60.25,8.14 v60.25,6.5 | U2.LE 84.96,7.57 84.96,8.54 81,12.5 73,12.5 72.25,11.75 63.5,11.75 62,10.25 v62,9.25
  Bottom 0.254: IC3.COUT 58.93,8.14 60.25,6.83 v60.25,6.5 62,8.25 v62,9.25
N$17  (via drill 0.35, 0.5)  (2 unrouted)
  Top 0.254: U1.BL 60.77,11.02 v64,14.25 | U2.BL 86.25,6.59 86.25,8.75 81.5,13.5 74.25,13.5 v73.5,14.25
  Bottom 0.254: v64,14.25 v73.5,14.25
  Bottom 0.305: IC3.DOUT 59.58,2.42 59.75,2.25 61,2.25 63.5,4.75 63.5,13.75 v64,14.25
N$18
  Bottom 0.305: C3.1 14.75,25.25 15.25,24.75 15.25,22.75 16.23,21.77 IC1.20
N$19
  Bottom 0.305: T1.E 17.75,29 17.85,28.9 R10.2 18.6,28.3 IC1.25
N$20
  Top 0.305: R3.1 127,10.67 RX.1
N$21  (1 unrouted)
  Bottom 0.305: R14.2 R13.2 81,24.35 S2.1
N$22  (1 unrouted)
  Bottom 0.305: R11.2 R12.2 97.5,24.5 S1.1
N$23
  Bottom 0.305: R14.1 C8.1 73.36,19.51 67.04,19.51 65.03,17.5 42.5,17.5 42,17 32.75,17 30.75,15 27.75,15 26,16.75 23.75,16.75 23.4,17.1 IC1.10
N$24
  Bottom 0.305: R12.1 C7.1 93.1,20.4 91.5,22 83,22 78,17 42.75,17 40.25,14.5 27.5,14.5 25.75,16.25 23.25,16.25 22.6,16.9 IC1.11
N$25  (1 unrouted)
  Bottom 0.305: R16.2 R15.2 49,24.85 S3.1
N$26
  Bottom 0.305: R16.1 C9.1 40.65,20.4 39.88,19.62 32.38,19.62 32,19.25 32,17 30.5,15.5 28,15.5 25.52,17.98 IC1.9
RST
  Bottom 0.305: IC1.29 21.8,27.3 22.25,27.75 23.6,27.75 R7.1 28.15,25.5 30.26,25.5 32.46,23.31 36.56,23.31 41,27.75 41,30.25 41.75,31 43.75,31 47.52,27.23 ICSP.5
SCK  (via drill 0.35, 0.5)
  Top 0.305: v31.75,4.5 28.25,8 28.25,13 25.25,16 18.5,16 v17,17.5 | v49.25,13.75 52.5,17 52.5,20.25 58.81,26.56 ICSP.3
  Bottom 0.305: IC1.17 17.2,17.7 v17,17.5 | v31.75,4.5 31.92,4.33 36.71,4.33 38,5.62 38,9.25 43.75,15 48,15 v49.25,13.75 50.25,13.75 53,11 56.5,11 56.98,10.52 IC3.AIN
SCL  (via drill 0.35)
  Top 0.305: v30,10 29.25,10.75 29.25,13.5 25.75,17 22.25,17 21,18.25 v21,24.5
  Bottom 0.305: R8.1 21,27.4 IC1.28 v21,24.5 | v30,10 30.5,9.5 30.5,3.5 32.25,1.75 37,1.75 38.5,3.25 38.5,9 40.5,11 RTC.SCL
SDA  (via drill 0.35, 0.5)
  Top 0.305: v29.5,8.75 28.75,9.5 28.75,13.25 25.5,16.5 22,16.5 19.75,18.75 v19.75,24.5
  Bottom 0.305: R9.1 20.2,28.85 IC1.27 20.2,24.95 v19.75,24.5 | v29.5,8.75 30,8.25 30,3.25 32,1.25 37.25,1.25 39,3 39,8.75 39.98,9.73 RTC.SDA
VCC  (via drill 0.35, 0.5)  (3 unrouted)
  Top 0.305: v62.75,18.5 62.75,14.25 61.75,13.25 55.5,13.25 | 55.5,13.25 53.5,15.25 | 55.5,13.25 55.5,12.75 v53,10.25
  Top 0.508: 53.5,15.25 v53.25,15.25
  Bottom 0.305: 17.1,20.27 IC1.18 | IC1.4 25.67,22.5 26.75,22.5 27.25,23 28.15,23 | C10.1 12.15,20.1 | IC1.18 15.93,20.18 15.25,19.5 13.25,19.5 12.15,18.4 C11.1 | IC1.18 18.2,20.18 19,20.98 IC1.6 27.1,20.98 27.57,20.5 28.15,20.5 C6.1 28.15,23 | R7.2 R8.2 R9.2 20.25,31.25 19.5,32 14.25,32 12.25,30 12.25,29.02 T1.C 10.5,27.27 10.5,23.5 11,23 C5.1 C10.1 | C10.1 C11.1 | IC2.3 10.75,6.84 10.75,14.6 C13.1 C11.1 | S3.3 51.25,31.75 60.62,31.75 61.35,31.02 | 61.35,31.02 ICSP.2 63.5,27.62 63.5,19.25 v62.75,18.5 | 61.35,31.02 62.73,32.4 71.6,32.4 S2.4 | S2.3 S1.4 | S3.4 42.5,28.25 37,22.75 31.5,22.75 31.25,23 29.75,23 | R18.2 C14.1 R19.2 53.35,15.35 | v53,10.25 52.9,10.15 | IC3.VCC 55.68,9.5 53.75,9.5 | 53.75,9.5 v53,10.25 | 53.75,9.5 C15.1 | RTC.VCC 52.48,9.73 v53,10.25 | C4.1 29.85,23.1 29.75,23 | 29.75,23 28.15,23
  Bottom 0.508: v53.25,15.25 53.35,15.35

### Text on the board
bPlace: v1.0
tNames: JLCJLCJLCJLC
bNames: G | MO | 5V | RS | CK | MI | GND | +5V | CR2032 / BAT | HV